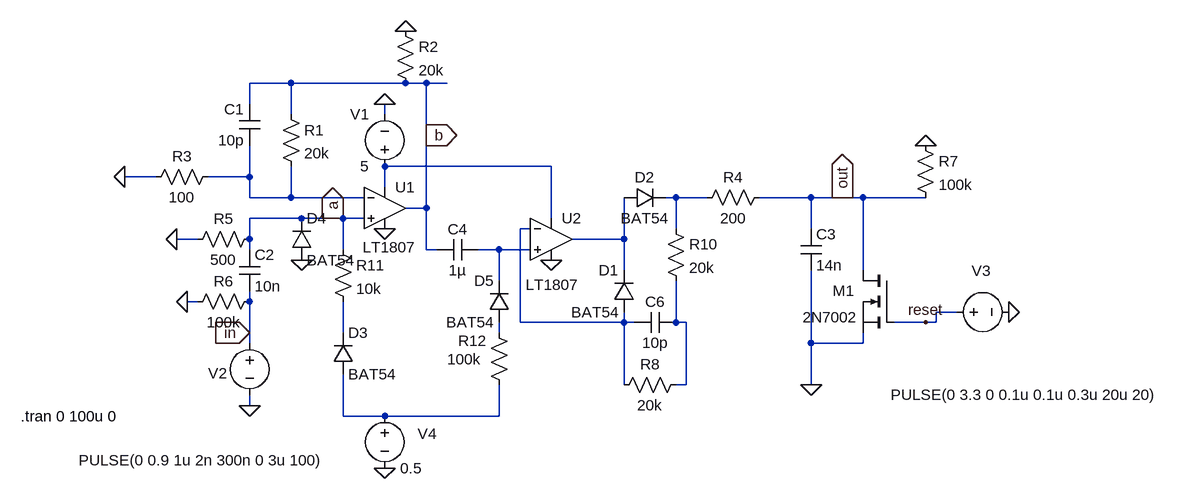
[diagram p0: schematic Draft1_c.asc]
Draft1_c.asc, the LTspice schematic file:
Version 4.1
SHEET 1 1284 680
WIRE -304 -48 -368 -48
WIRE -128 -48 -304 -48
WIRE -96 -48 -128 -48
WIRE -64 -48 -96 -48
WIRE -368 -16 -368 -48
WIRE -304 0 -304 -48
WIRE -160 0 -160 -16
WIRE -96 32 -96 -48
WIRE 96 80 -160 80
WIRE -512 96 -560 96
WIRE -368 96 -368 48
WIRE -368 96 -432 96
WIRE -160 112 -160 80
WIRE -368 128 -368 96
WIRE -304 128 -304 80
WIRE -304 128 -368 128
WIRE -192 128 -304 128
WIRE 288 128 272 128
WIRE 336 128 288 128
WIRE 496 128 416 128
WIRE 544 128 496 128
WIRE 576 128 544 128
WIRE 672 128 576 128
WIRE -96 144 -96 32
WIRE -96 144 -128 144
WIRE -288 160 -368 160
WIRE -240 160 -288 160
WIRE -224 160 -240 160
WIRE -192 160 -224 160
WIRE 96 160 96 80
WIRE 64 176 48 176
WIRE 288 176 288 128
WIRE 496 176 496 128
WIRE -448 192 -480 192
WIRE -368 192 -368 160
WIRE 208 192 208 128
WIRE 208 192 128 192
WIRE -368 208 -368 192
WIRE -224 208 -224 160
WIRE -96 208 -96 144
WIRE -80 208 -96 208
WIRE 16 208 -16 208
WIRE 64 208 16 208
WIRE 208 240 208 192
WIRE 576 240 576 128
WIRE 16 256 16 208
WIRE -448 288 -464 288
WIRE -368 288 -368 272
WIRE 720 304 688 304
WIRE 48 320 48 176
WIRE 208 320 208 304
WIRE 208 320 48 320
WIRE 224 320 208 320
WIRE 288 320 288 256
WIRE 304 320 288 320
WIRE 672 320 624 320
WIRE 688 320 688 304
WIRE 688 320 672 320
WIRE -368 336 -368 288
WIRE -224 336 -224 288
WIRE 16 336 16 320
WIRE -368 352 -368 336
WIRE 496 352 496 240
WIRE 576 352 576 336
WIRE 576 352 496 352
WIRE 208 416 208 320
WIRE 304 416 304 320
WIRE 304 416 288 416
WIRE 496 416 496 352
WIRE -368 448 -368 432
WIRE -224 464 -224 400
WIRE -160 464 -224 464
WIRE 16 464 16 416
WIRE 16 464 -160 464
FLAG -160 -16 0
FLAG -560 96 0
FLAG -96 32 b
IOPIN -96 32 Out
FLAG -368 448 0
FLAG -240 160 a
IOPIN -240 160 Out
FLAG -160 176 0
FLAG 496 416 0
FLAG 544 128 out
IOPIN 544 128 Out
FLAG -368 336 in
IOPIN -368 336 In
FLAG -464 288 0
FLAG 672 48 0
FLAG 672 320 reset
FLAG 800 304 0
FLAG 96 224 0
FLAG -128 -128 0
FLAG -480 192 0
FLAG -160 544 0
FLAG -288 224 0
SYMBOL OpAmps\\LT1807 -160 80 R0
WINDOW 3 217 182 Left 2
SYMATTR InstName U1
SYMBOL voltage -160 96 R180
WINDOW 0 24 96 Left 2
WINDOW 3 24 16 Left 2
WINDOW 123 0 0 Left 0
WINDOW 39 0 0 Left 0
SYMATTR InstName V1
SYMATTR Value 5
SYMBOL voltage -368 336 R0
WINDOW 123 24 124 Left 2
WINDOW 39 -34 231 Left 2
WINDOW 0 -64 62 Left 2
WINDOW 3 -263 196 Left 2
SYMATTR InstName V2
SYMATTR Value PULSE(0 0.9 1u 2n 300n 0 3u 100)
SYMBOL cap -384 208 R0
SYMATTR InstName C2
SYMATTR Value 10n
SYMBOL cap 480 176 R0
SYMATTR InstName C3
SYMATTR Value 14n
SYMBOL res 432 112 R90
WINDOW 0 0 56 VBottom 2
WINDOW 3 32 56 VTop 2
SYMATTR InstName R4
SYMATTR Value 200
SYMBOL diode 208 144 R270
WINDOW 0 32 32 VTop 2
WINDOW 3 0 32 VBottom 2
SYMATTR InstName D2
SYMATTR Value BAT54
SYMBOL res -352 272 R90
WINDOW 0 0 56 VBottom 2
WINDOW 3 32 56 VTop 2
SYMATTR InstName R6
SYMATTR Value 100k
SYMBOL nmos 624 240 M0
WINDOW 0 61 31 Left 2
SYMATTR InstName M1
SYMATTR Value 2N7002
SYMBOL voltage 704 304 R270
WINDOW 0 48 54 VTop 2
WINDOW 3 -112 120 VBottom 2
WINDOW 123 0 0 Left 0
WINDOW 39 0 0 Left 0
SYMATTR InstName V3
SYMATTR Value PULSE(0 3.3 0 0.1u 0.1u 0.3u 20u 20)
SYMBOL diode 224 304 R180
WINDOW 0 24 64 Left 2
WINDOW 3 24 0 Left 2
SYMATTR InstName D1
SYMATTR Value BAT54
SYMBOL res 272 160 R0
SYMATTR InstName R10
SYMATTR Value 20k
SYMBOL cap -352 48 R180
WINDOW 0 24 56 Left 2
WINDOW 3 24 8 Left 2
SYMATTR InstName C1
SYMATTR Value 10p
SYMBOL res -320 -16 R0
SYMATTR InstName R1
SYMATTR Value 20k
SYMBOL res -416 80 R90
WINDOW 0 0 56 VBottom 2
WINDOW 3 32 56 VTop 2
SYMATTR InstName R3
SYMATTR Value 100
SYMBOL res -352 176 R90
WINDOW 0 0 56 VBottom 2
WINDOW 3 32 56 VTop 2
SYMATTR InstName R5
SYMATTR Value 500
SYMBOL res -144 -144 R0
SYMATTR InstName R2
SYMATTR Value 20k
SYMBOL OpAmps\\LT1807 96 128 R0
WINDOW 3 -290 76 Left 2
SYMATTR InstName U2
SYMBOL res 656 32 R0
SYMATTR InstName R7
SYMATTR Value 100k
SYMBOL cap -16 192 R90
WINDOW 0 0 32 VBottom 2
WINDOW 3 32 32 VTop 2
SYMATTR InstName C4
SYMATTR Value 1µ
SYMBOL cap 288 304 R90
WINDOW 0 0 32 VBottom 2
WINDOW 3 32 32 VTop 2
SYMATTR InstName C6
SYMATTR Value 10p
SYMBOL res 304 400 R90
WINDOW 0 0 56 VBottom 2
WINDOW 3 32 56 VTop 2
SYMATTR InstName R8
SYMATTR Value 20k
SYMBOL res -240 192 R0
SYMATTR InstName R11
SYMATTR Value 10k
SYMBOL res 0 320 R0
WINDOW 0 -47 28 Left 2
WINDOW 3 -64 57 Left 2
SYMATTR InstName R12
SYMATTR Value 100k
SYMBOL voltage -160 448 R0
WINDOW 123 0 0 Left 0
WINDOW 39 0 0 Left 0
WINDOW 0 51 43 Left 2
SYMATTR InstName V4
SYMATTR Value 0.5
SYMBOL diode -240 400 M180
WINDOW 0 24 64 Left 2
WINDOW 3 24 0 Left 2
SYMATTR InstName D3
SYMATTR Value BAT54
SYMBOL diode -304 224 M180
WINDOW 0 24 64 Left 2
WINDOW 3 24 0 Left 2
SYMATTR InstName D4
SYMATTR Value BAT54
SYMBOL diode 32 320 R180
WINDOW 0 24 64 Left 2
WINDOW 3 24 0 Left 2
SYMATTR InstName D5
SYMATTR Value BAT54
TEXT -720 464 Left 2 !.tran 0 100u 0

The netlist it stands for:
* Draft1_c.asc
X§U1 a N002 N001 0 b LT1807  ; pins In+ In- V+ V- OUT
V1 N001 0 5
V2 in 0 PULSE(0 0.9 1u 2n 300n 0 3u 100)
C2 a in 10n
C3 out 0 14n
R4 out N003 200
D2 N005 N003 BAT54
R6 in 0 100k
M1 out reset 0 0 2N7002
V3 reset 0 PULSE(0 3.3 0 0.1u 0.1u 0.3u 20u 20)
D1 N004 N005 BAT54
R10 N003 N007 20k
C1 N002 b 10p
R1 b N002 20k
R3 N002 0 100
R5 a 0 500
R2 0 b 20k
X§U2 N006 N004 N001 0 N005 LT1807  ; pins In+ In- V+ V- OUT
R7 0 out 100k
C4 N006 b 1µ
C6 N007 N004 10p
R8 N007 N004 20k
R11 a N008 10k
R12 N009 N010 100k
V4 N010 0 0.5
D3 N010 N008 BAT54
D4 0 a BAT54
D5 N009 N006 BAT54
.model D D
.lib standard.dio
.model NMOS NMOS
.model PMOS PMOS
.lib standard.mos
.tran 0 100u 0
.backanno
.end